# EAGLE design BoilerInterfaceV00 (EAGLE 8.5.2)
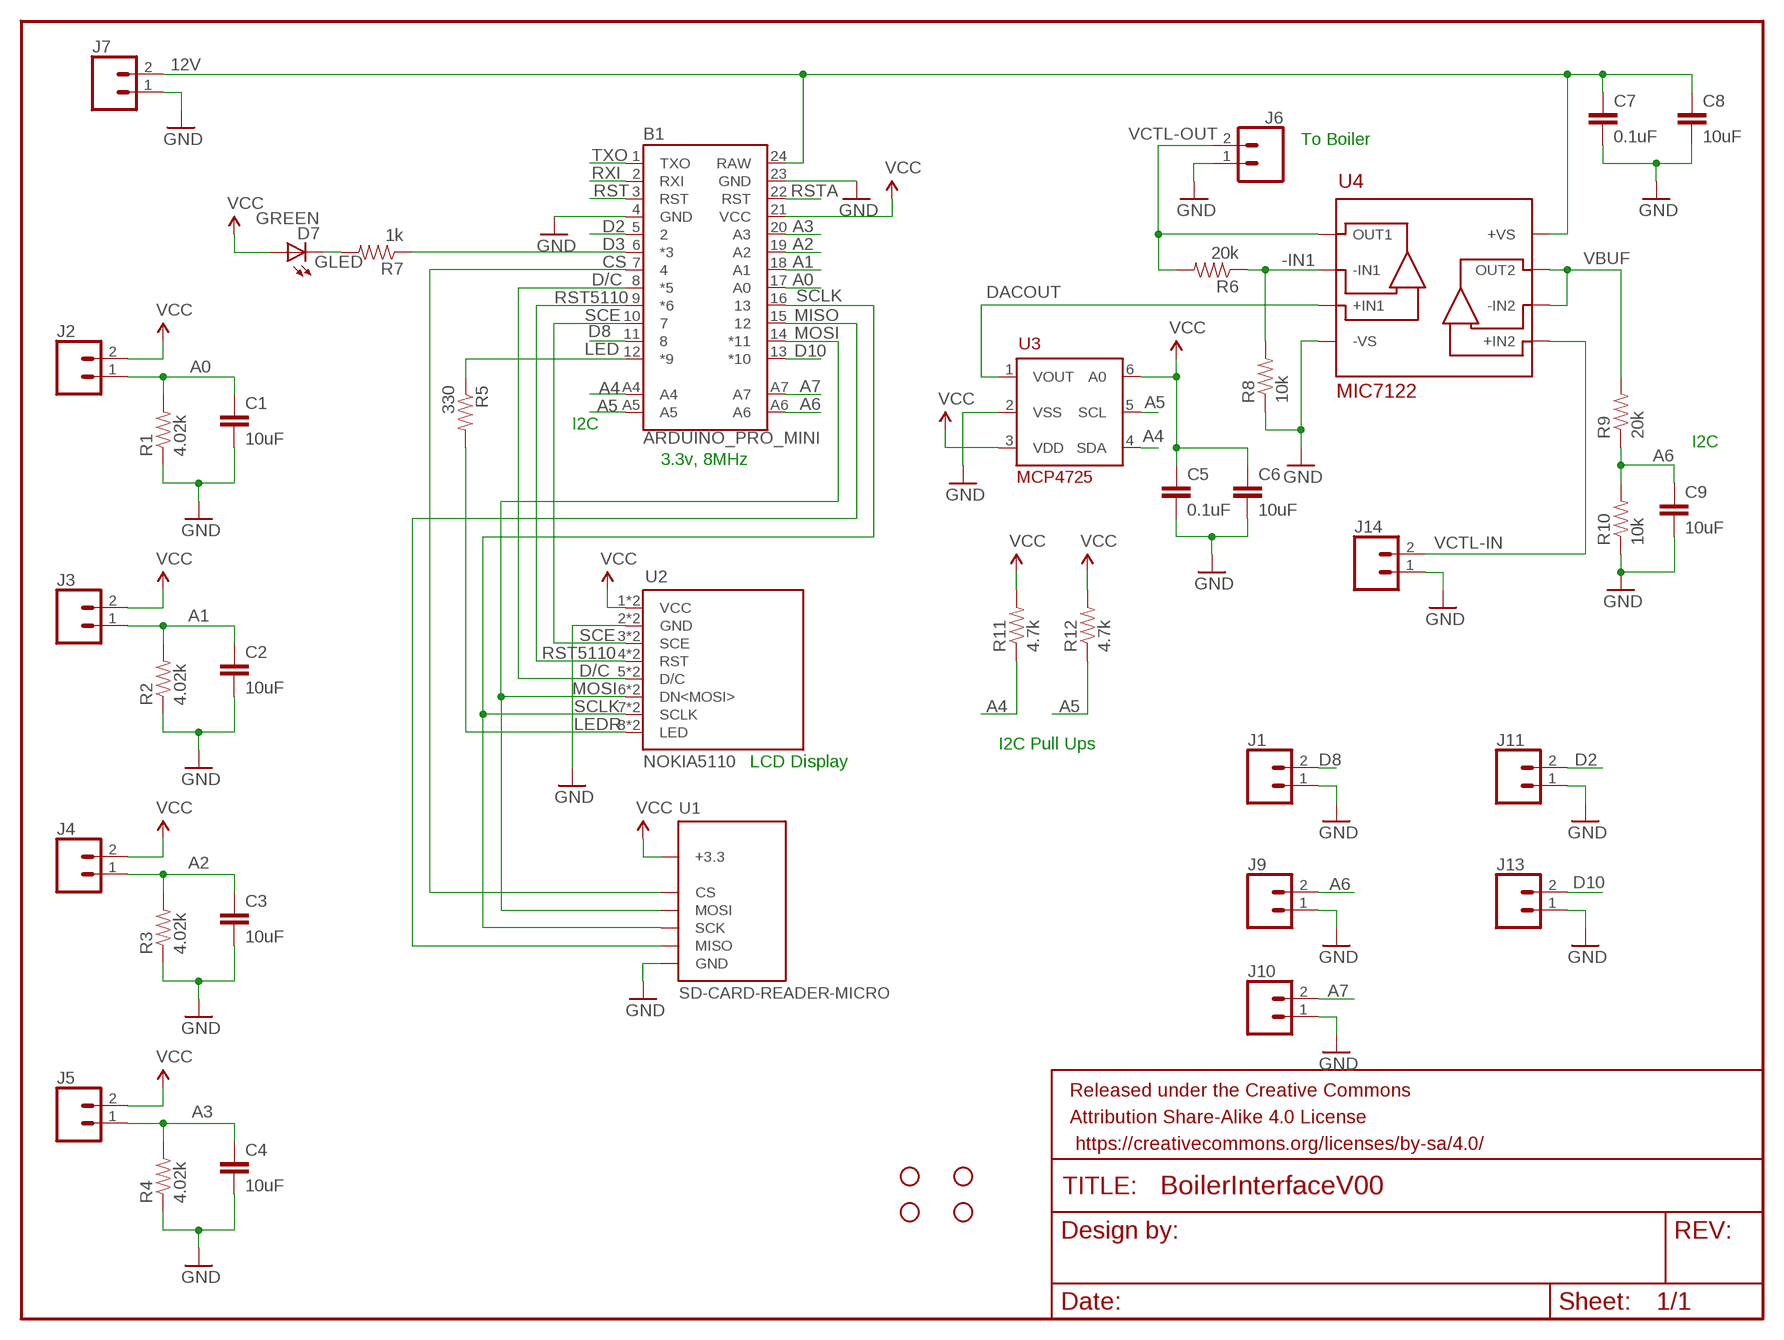
[diagram p0: schematic, sheet 1]

## Parts
B1  ARDUINO_PRO_MINI  [ARDUINO_PRO_MINI]
C1  10uF  CAP0805  [0805]
C2  10uF  CAP0805  [0805]
C3  10uF  CAP0805  [0805]
C4  10uF  CAP0805  [0805]
C5  0.1uF  CAP0805  [0805]
C6  10uF  CAP0805  [0805]
C7  0.1uF  CAP0805  [0805]
C8  10uF  CAP0805  [0805]
C9  10uF  CAP0805  [0805]
D7  GREEN  LED-GREEN0603  [LED-0603]
FRAME1  FRAME-LETTER  [CREATIVE_COMMONS]
J1  CONN_02  [1X02]
J2  CONN_025MM  [SCREWTERMINAL-5MM-2]
J3  CONN_025MM  [SCREWTERMINAL-5MM-2]
J4  CONN_025MM  [SCREWTERMINAL-5MM-2]
J5  CONN_025MM  [SCREWTERMINAL-5MM-2]
J6  CONN_025MM  [SCREWTERMINAL-5MM-2]
J7  CONN_025MM  [SCREWTERMINAL-5MM-2]
J9  CONN_02  [1X02]
J10  CONN_02  [1X02]
J11  CONN_02  [1X02]
J13  CONN_02  [1X02]
J14  CONN_025MM  [SCREWTERMINAL-5MM-2]
R1  4.02k  RESISTOR0805-RES  [0805]
R2  4.02k  RESISTOR0805-RES  [0805]
R3  4.02k  RESISTOR0805-RES  [0805]
R4  4.02k  RESISTOR0805-RES  [0805]
R5  330  RESISTOR0603  [0603-RES]
R6  20k  RESISTOR0805-RES  [0805]
R7  1k  RESISTOR0805-RES  [0805]
R8  10k  RESISTOR0805-RES  [0805]
R9  20k  RESISTOR0805-RES  [0805]
R10  10k  RESISTOR0805-RES  [0805]
R11  4.7k  RESISTOR0805-RES  [0805]
R12  4.7k  RESISTOR0805-RES  [0805]
STANDOFF1  STAND-OFF  [STAND-OFF]
STANDOFF2  STAND-OFF  [STAND-OFF]
STANDOFF3  STAND-OFF  [STAND-OFF]
STANDOFF4  STAND-OFF  [STAND-OFF]
U1  SD-CARD-READER-MICRO  [MICROSD_MOLEX]
U2  NOKIA5110  [NOKIA5110]
U3  MCP4725  [SOT23-6L]
U4  MIC7122  [MSOP8]

## Nets
12V: B1.24(RAW) C7.1 C8.1 J7.2 U4.8(+VS)
-IN1: R6.1 R8.2 U4.2(-IN1)
A0: B1.17(A0) C1.1 J2.1 R1.2
A1: B1.18(A1) C2.1 J3.1 R2.2
A2: B1.19(A2) C3.1 J4.1 R3.2
A3: B1.20(A3) C4.1 J5.1 R4.2
A4: B1.A4 R11.1 U3.4(SDA)
A5: B1.A5 R12.1 U3.5(SCL)
A6: B1.A6 C9.1 J9.2 R9.1 R10.2
A7: B1.A7 J10.2
CS: B1.7 U1.P$2(CS)
D2: B1.5 J11.2
D3: B1.6(*3) R7.1
D8: B1.11 J1.2
D10: B1.13(*10) J13.2
D/C: B1.8(*5) U2.5(D/C) U2.13(D/C)
DACOUT: U3.1(VOUT) U4.3(+IN1)
GLED: D7.C R7.2
GND: B1.4(GND) B1.23(GND) C1.2 C2.2 C3.2 C4.2 C5.2 C6.2 C7.2 C8.2 C9.2 J1.1 J6.1 J7.1 J9.1 J10.1 J11.1 J13.1 J14.1 R1.1 R2.1 R3.1 R4.1 R8.1 R10.1 U1.P$6(GND) U1.P$9(GND) U1.P$10(GND) U1.P$11(GND) U1.P$12(GND) U2.2(GND) U2.10(GND) U3.2(VSS) U4.4(-VS)
LED: B1.12(*9) R5.1
LEDR: R5.2 U2.8(LED) U2.16(LED)
MISO: B1.15 U1.P$7(MISO)
MOSI: B1.14(*11) U1.P$3(MOSI) U2.6(DN<MOSI>) U2.14(DN<MOSI>)
RST: B1.3(RST)
RST5110: B1.9(*6) U2.4(RST) U2.12(RST)
RSTA: B1.22(RST)
RXI: B1.2(RXI)
SCE: B1.10 U2.3(SCE) U2.11(SCE)
SCLK: B1.16 U1.P$5(SCK) U2.7(SCLK) U2.15(SCLK)
TXO: B1.1(TXO)
VBUF: R9.2 U4.6(-IN2) U4.7(OUT2)
VCC: B1.21(VCC) C5.1 C6.1 D7.A J2.2 J3.2 J4.2 J5.2 R11.2 R12.2 U1.P$4(+3.3) U2.1(VCC) U2.9(VCC) U3.3(VDD) U3.6(A0)
VCTL-IN: J14.2 U4.5(+IN2)
VCTL-OUT: J6.2 R6.2 U4.1(OUT1)

## Notes on the sheet
- To Boiler
- I2C
- I2C
- 3.3v, 8MHz
- I2C Pull Ups
- LCD Display

## Library data of the parts
B1 = SparkFun-Boards:ARDUINO_PRO_MINI: SparkFun Pro Mini Pro Mini compatible footprint. Dimensions: 0.7 x 1.3" PCB Thickness: 0.8mm SparkFun Products: 3.3V/8MHz <https://www.sparkfun.com/products/11114> 5V/16MHz <https://www.sparkfun.com/products/11113>
C1-C9 = SparkFun-Passives:CAP: Capacitor Standard 0603 ceramic capacitor, and 0.1" leaded capacitor.
D7 = SparkFun-LED:LED-GREEN: Various green LEDs Green LEDs used in SFE Production 0603- DIO-00821 LARGE- DIO-00862 LILYPAD- DIO-09910; PROD_ID: DIO-00821
FRAME1 = SparkFun-Aesthetics:FRAME-LETTER: Schematic Frame Standard 8.5x11 US Letter frame
J1 J9-J11 J13 = SparkFun-Connectors:CONN_02: Multi connection point. Often used as Generic Header-pin footprint for 0.1 inch spaced/style header connections On any of the 0.1 inch spaced packages, you can populate with these: Break Away Headers - Straight <https://www.sparkfun.com/products/116> (PRT-00116) Break Away Male Headers - Right Angle <https://www.sparkfun.com/products/553> (PRT-00553) Female Headers <https://www.sparkfun.com/products/115> (PRT-00115) Break Away Headers - Machine Pin <https://www.sparkfun.com/products/117> (PRT-00117) Break Away Female Headers - Swiss Machine Pin <https://www.sparkfun.com/products/743> (PRT-00743) For SCREWTERMINALS and SPRING TERMINALS visit here: Screw Terimnals on SparkFun.com <https://www.sparkfun.com/search/results?term=Screw+Terminals> (5mm/3.5mm/2.54mm spacing) This device is also useful as a general connection point to wire up your design to another part of your project. Our various solder wires solder well into these plated through hole pads. Hook-Up Wire - Assortment (Stranded, 22 AWG) <https://www.sparkfun.com/products/11375> (PRT-11375) Hook-Up Wire - Assortment (Solid Core, 22 AWG) <https://www.sparkfun.com/products/11367> (PRT-11367) View the entire wire category on our website here <https://www.sparkfun.com/categories/141> Special notes: Molex polarized connector foot print use with: PRT-08233 with associated crimp pins and housings. 2.54_SCREWTERM for use with PRT-10571. 3.5mm Screw Terminal footprints for PRT-08084 5mm Screw Terminal footprints for use with PRT-08432
J2-J7 J14 = SparkFun-Connectors:CONN_02: Multi connection point. Often used as Generic Header-pin footprint for 0.1 inch spaced/style header connections On any of the 0.1 inch spaced packages, you can populate with these: Break Away Headers - Straight <https://www.sparkfun.com/products/116> (PRT-00116) Break Away Male Headers - Right Angle <https://www.sparkfun.com/products/553> (PRT-00553) Female Headers <https://www.sparkfun.com/products/115> (PRT-00115) Break Away Headers - Machine Pin <https://www.sparkfun.com/products/117> (PRT-00117) Break Away Female Headers - Swiss Machine Pin <https://www.sparkfun.com/products/743> (PRT-00743) For SCREWTERMINALS and SPRING TERMINALS visit here: Screw Terimnals on SparkFun.com <https://www.sparkfun.com/search/results?term=Screw+Terminals> (5mm/3.5mm/2.54mm spacing) This device is also useful as a general connection point to wire up your design to another part of your project. Our various solder wires solder well into these plated through hole pads. Hook-Up Wire - Assortment (Stranded, 22 AWG) <https://www.sparkfun.com/products/11375> (PRT-11375) Hook-Up Wire - Assortment (Solid Core, 22 AWG) <https://www.sparkfun.com/products/11367> (PRT-11367) View the entire wire category on our website here <https://www.sparkfun.com/categories/141> Special notes: Molex polarized connector foot print use with: PRT-08233 with associated crimp pins and housings. 2.54_SCREWTERM for use with PRT-10571. 3.5mm Screw Terminal footprints for PRT-08084 5mm Screw Terminal footprints for use with PRT-08432; SF_SKU: PRT-08432
R1-R4 R6 R8-R12 = SparkFun-Passives:RESISTOR: Resistor Basic schematic elements and footprints for 0603, 1206, and PTH resistors.
R5 R7 = SparkFun-Resistors:RESISTOR: Resistor Basic schematic elements and footprints for 0603, 1206, and PTH resistors.
STANDOFF1-STANDOFF4 = SparkFun-Electromechanical:STAND-OFF: #4 Stand Off This is the mechanical footprint for a #4 phillips button head screw. Use the keepout ring to avoid running the screw head into surrounding components. SKU : PRT-00447
U1 = KDA:SD-CARD-READER-MICRO
U2 = KDA:NOKIA5110
U3 = KDA:MCP4725
U4 = KDA:MIC7122

## Board
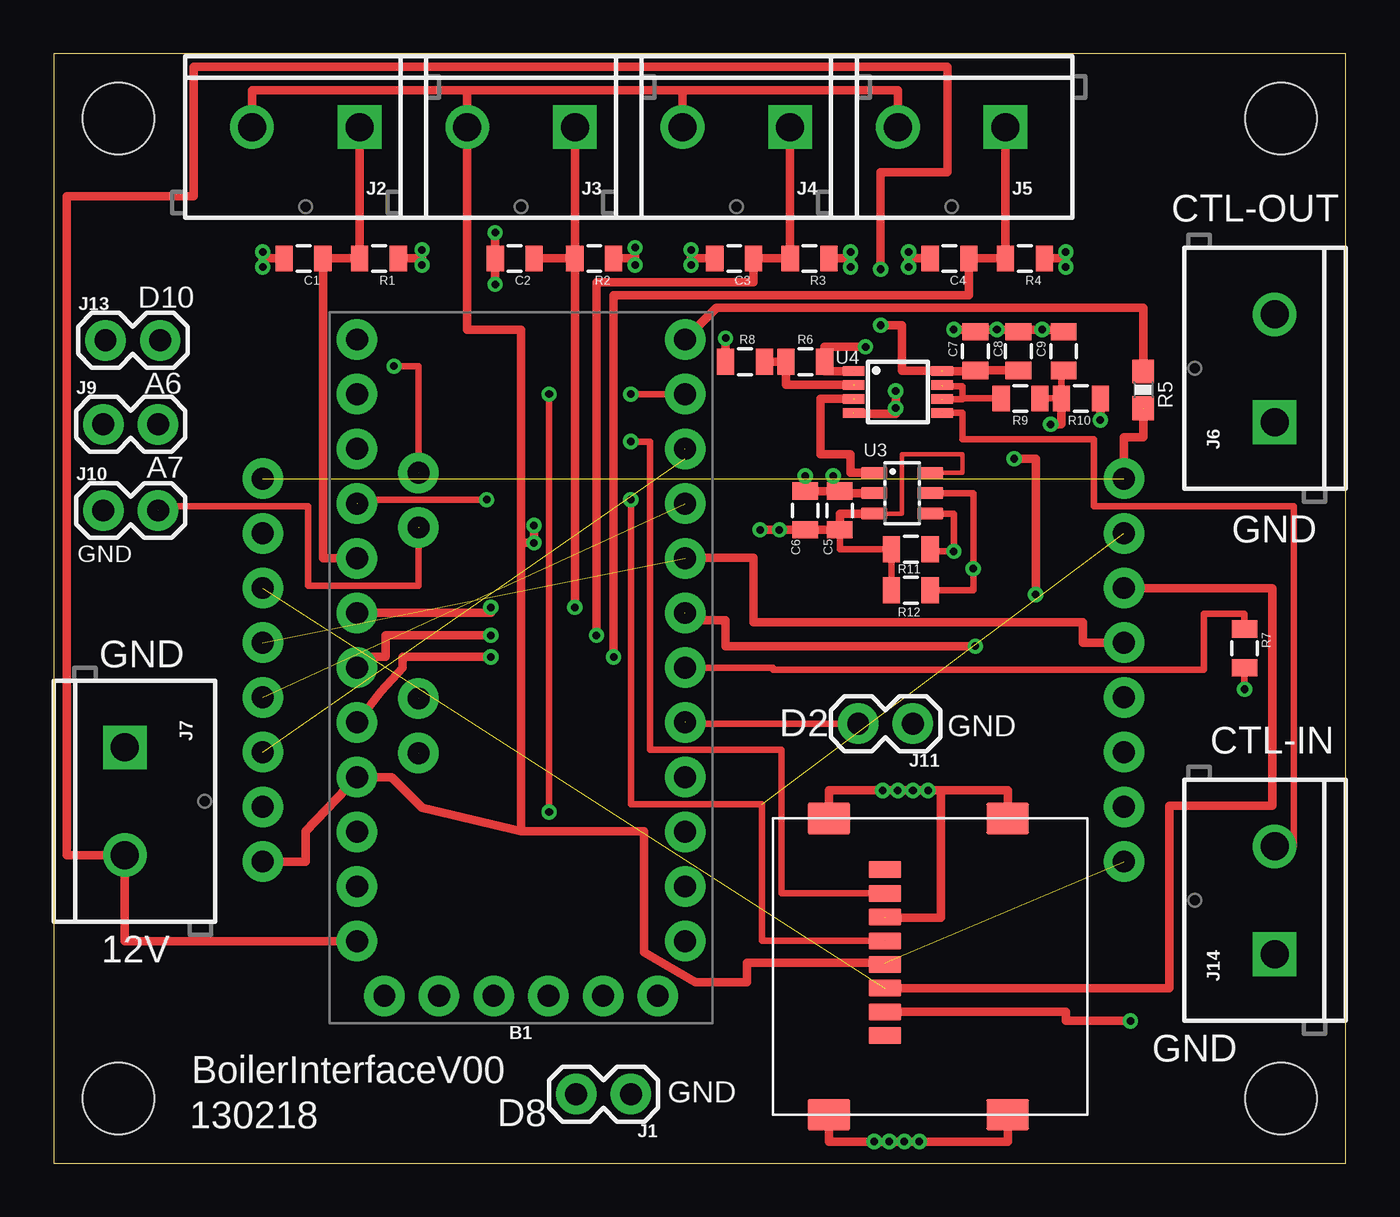
[diagram p1: board, top side]
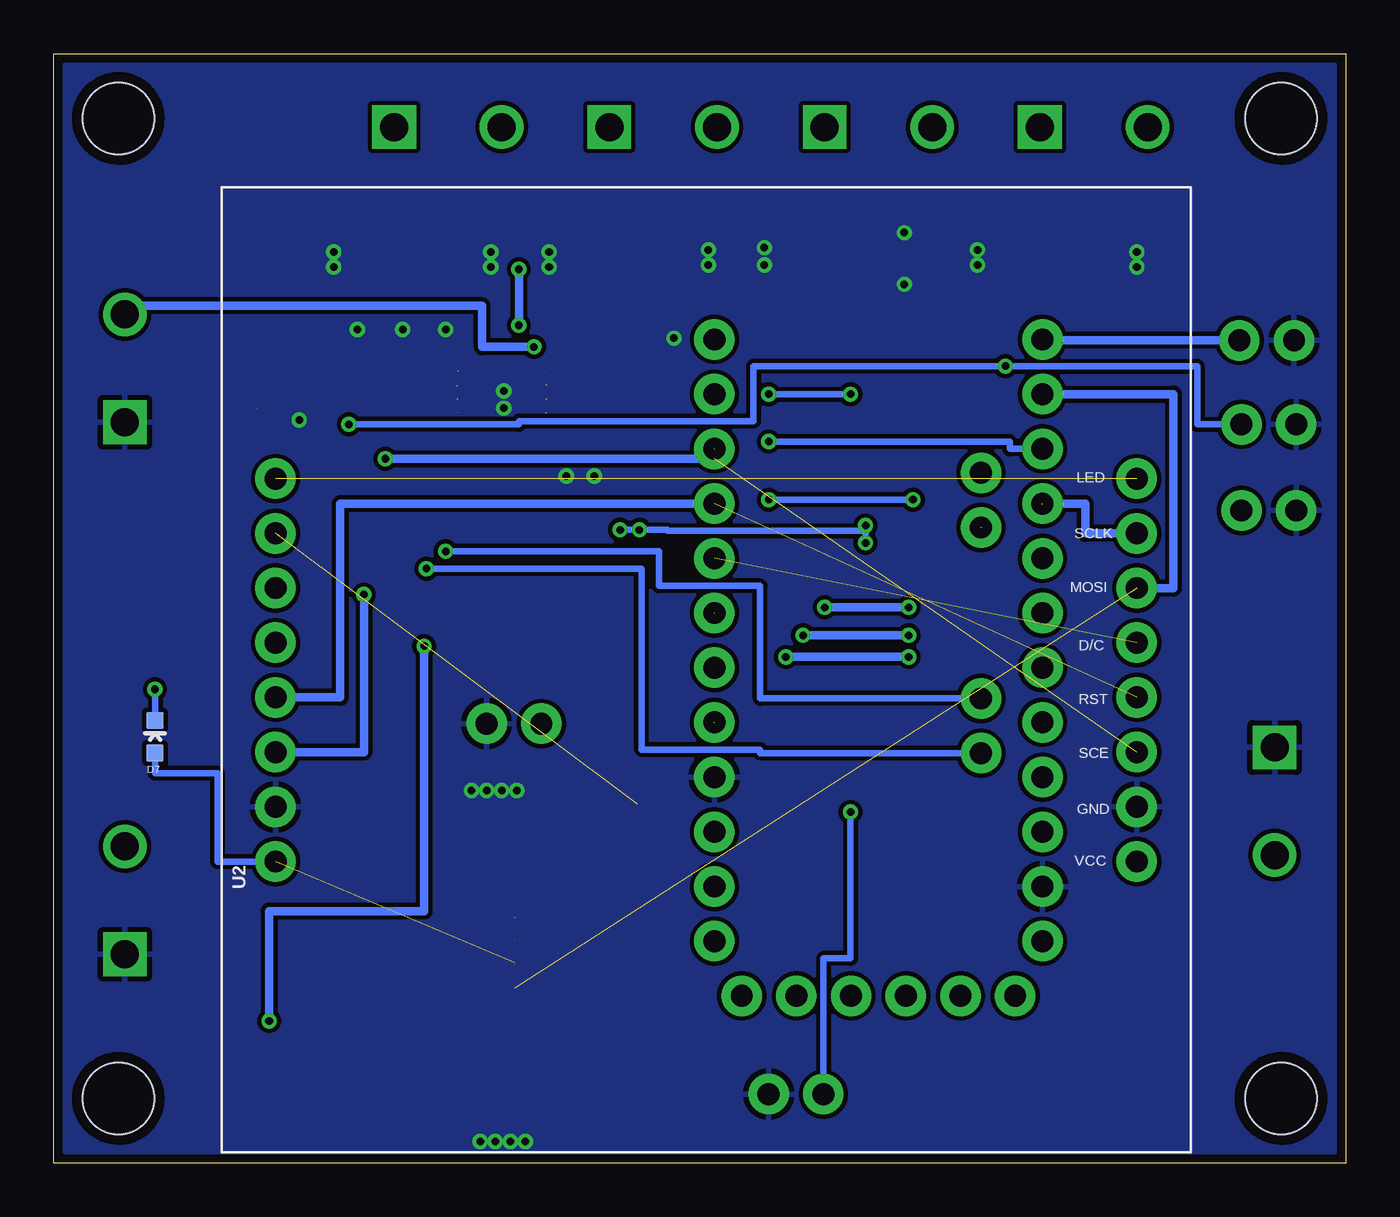
[diagram p2: board, bottom side, seen from below]

Size 60 x 51.5 mm. Coordinates in mm from the lower left corner, seen from the top.
Outline: 0,0 60,0 60,51.5 0,51.5 0,0
Copper layers (1*16): Top 0.0356mm / dielectric 1.5011mm / Bottom 0.0356mm
Design rules "Oshpark_mm": minimum track width 0.15mm, minimum drill 0.33mm, track to track 0.15mm, track to pad 0.15mm, pad to pad 0.15mm, via to via 0.15mm, smd to smd 0.15mm, copper to edge 0.38mm, drill to drill 0.15mm, minimum pad ring 7mil, minimum via ring 7mil, stop-mask expansion 3mil, vias tented up to drill 0mil, thermal gap 10mil

### Footprints (pad centres in the part's own frame; a part is rotated, then mirrored left to right if it is on the bottom)
ARDUINO_PRO_MINI = drill 1.016 pad 1.88: 1 -7.62,12.7; 2 -7.62,10.16; 3 -7.62,7.62; 4 -7.62,5.08; 5 -7.62,2.54; 6 -7.62,0; 7 -7.62,-2.54; 8 -7.62,-5.08; 9 -7.62,-7.62; 10 -7.62,-10.16; 11 -7.62,-12.7; 12 -7.62,-15.24; 13 7.62,-15.24; 14 7.62,-12.7; 15 7.62,-10.16; 16 7.62,-7.62; 17 7.62,-5.08; 18 7.62,-2.54; 19 7.62,0; 20 7.62,2.54; 21 7.62,5.08; 22 7.62,7.62; 23 7.62,10.16; 24 7.62,12.7; A4 4.763,1.429; A5 4.763,3.969; A6 4.763,-9.049; A7 4.763,-6.509; BLK -6.35,15.24; GND -3.81,15.24; GRN 6.35,15.24; RXI 1.27,15.24; TXO 3.81,15.24; VCC -1.27,15.24
0805 = smd 0.8 x 1.2: 1 -0.9,0; 2 0.9,0
LED-0603 = smd 0.8 x 0.8: A 0,-0.75; C 0,0.75
1X02 = drill 1.016 pad 1.88: 1 0,0; 2 2.54,0
SCREWTERMINAL-5MM-2 = drill 1.3 pad 2.032 square: 1 0,0 | drill 1.3 pad 2.032: 2 5,0
0603-RES = smd 1.1 x 1: 1 -0.85,0; 2 0.85,0
STAND-OFF = hole 3.302: 0,0
MICROSD_MOLEX = smd 0.8 x 1.5: P$1 10.08,2.6; P$2 8.98,2.6; P$3 7.88,2.6; P$4 6.78,2.6; P$5 5.68,2.6; P$6 4.58,2.6; P$7 3.48,2.6; P$8 2.38,2.6 | smd 1.45 x 2: P$9 0,0; P$10 13.75,0; P$11 13.75,8.3; P$12 0,8.3
NOKIA5110 = drill 1.016 pad 1.88: 1 0,0; 2 0,2.54; 3 0,5.08; 4 0,7.62; 5 0,10.16; 6 0,12.7; 7 0,15.24; 8 0,17.78; 9 40,0; 10 40,2.54; 11 40,5.08; 12 40,7.62; 13 40,10.16; 14 40,12.7; 15 40,15.24; 16 40,17.78
SOT23-6L = smd 0.55 x 1.2: 1 -0.95,-1.3; 2 0,-1.3; 3 0.95,-1.3; 4 0.95,1.3; 5 0,1.3; 6 -0.95,1.3
MSOP8 = smd 0.45 x 1: 1 -0.975,-2.05; 2 -0.325,-2.05; 3 0.325,-2.05; 4 0.975,-2.05; 5 0.975,2.05; 6 0.325,2.05; 7 -0.325,2.05; 8 -0.975,2.05

### Placement (x,y rotation side)
B1  21.7,23 180 top
C1  11.6,42 180 top
C2  21.4,42 180 top
C3  31.6,42 180 top
C4  41.6,42 180 top
C5  36.5,30.3 90 top
C6  34.9,30.3 90 top
C7  42.8,37.7 90 top
C8  44.8,37.7 90 top
C9  46.9,37.7 90 top
D7  55.3,19.8 0 bottom
FRAME1  0,0 0 top
J1  26.8,3.2 180 top
J2  14.2,48.1 180 top
J3  24.2,48.1 180 top
J4  34.2,48.1 180 top
J5  44.2,48.1 180 top
J6  56.7,34.4 90 top
J7  3.3,19.3 270 top
J9  2.3,34.3 0 top
J10  2.3,30.3 0 top
J11  39.9,20.4 180 top
J13  2.4,38.2 0 top
J14  56.7,9.7 90 top
R1  15.1,42 180 top
R2  25.1,42 180 top
R3  35.1,42 180 top
R4  45.1,42 180 top
R5  50.6,35.9 270 top
R6  34.9,37.2 0 top
R7  55.3,23.9 270 top
R8  32.1,37.2 0 top
R9  44.9,35.5 180 top
R10  47.7,35.5 180 top
R11  39.8,28.5 180 top
R12  39.8,26.6 180 top
STANDOFF1  3,3 0 top
STANDOFF2  57,48.5 0 top
STANDOFF3  57,3 0 top
STANDOFF4  3,48.5 0 top
U1  36,16 270 top
U2  49.7,14 0 bottom
U3  39.4,31.1 270 top
U4  39.2,35.8 270 top

### Tracks (layer width: path | path; a pad name or v marks a point on that pad's centre or on a via)
12V  (via drill 0.35)  (2 unrouted)
  Top 0.4: B1.24 3.3,10.3 J7.2 0.6,14.3 0.6,44.9 6.5,44.9 6.5,50.9 41.5,50.9 41.5,46 38.4,46 v38.4,41.5 | C8.1 C7.1 42.8,36.77 U4.8 | U4.8 39.4,36.78 39.4,38.9 v38.4,38.9
  Bottom 0.4: v38.4,38.9 v38.4,41.5
-IN1  (1 unrouted)
  Top 0.4: R8.2 R6.1 34,36.13 U4.2
A0
  Top 0.4: J2.1 R1.2 C1.1 12.5,28.08 B1.17
A1  (via drill 0.35)
  Top 0.4: R2.2 J3.1 | C2.1 R2.2 | R2.2 v24.2,25.8 | v20.3,25.8 20.3,25.54 B1.18
  Bottom 0.4: v20.3,25.8 v24.2,25.8
A2  (via drill 0.35)
  Top 0.4: J4.1 R3.2 C3.1 32.5,40.9 25.2,40.9 v25.2,24.5 | v20.3,24.5 15.4,24.5 15.4,23.5 14.08,23.5 B1.19
  Bottom 0.4: v25.2,24.5 v20.3,24.5
A3  (via drill 0.35)
  Top 0.4: J5.1 R4.2 C4.1 42.5,40.3 26,40.3 v26,23.5 | v20.3,23.5 16.2,23.5 16.2,23 15.2,21.9 B1.20
  Bottom 0.4: v26,23.5 v20.3,23.5
A4  (via drill 0.35)  (1 unrouted)
  Top 0.3: U3.4 41.8,30.15 v41.8,28.4 40.7,28.4 R11.1
  Bottom 0.3: B1.A4 27.2,21.57 27.2,26.8 31.9,26.8 31.9,28.4 v41.8,28.4
A5  (via drill 0.35)  (1 unrouted)
  Top 0.3: U3.5 42.7,31.1 v42.7,27.6 42.7,26.6 R12.1
  Bottom 0.3: B1.A5 27.2,19.03 27.2,19.2 32.7,19.2 32.7,27.6 v42.7,27.6
A6  (via drill 0.35)  (1 unrouted)
  Top 0.3: B1.A6 16.94,37 v15.8,37 | R9.1 R10.2 46.8,36.8 C9.1
  Top 0.4: v46.3,34.3 46.8,34.3 R10.2
  Bottom 0.3: J9.2 6.9,34.3 6.9,37 v15.8,37 27.5,37 27.5,34.45 38.4,34.45 38.4,34.3 v46.3,34.3
A7  (2 unrouted)
  Top 0.3: B1.A7 16.94,26.8 11.8,26.8 11.8,30.5 4.85,30.5 J10.2
CS  (via drill 0.35)  (1 unrouted)
  Top 0.4: B1.7 29.32,25.2 31.2,25.2 31.2,24 v42.8,24 | v50,6.6 47,6.6 47,7.02 U1.P$2
  Bottom 0.4: v42.8,24 42.8,11.7 50,11.7 v50,6.6
D2  (1 unrouted)
  Top 0.3: J11.2 29.33,20.4 B1.5
D3
  Top 0.3: B1.6 33.4,23 33.4,22.9 53.4,22.9 53.4,25.5 55.3,25.5 R7.1
D8  (via drill 0.35)
  Top 0.3: B1.11 v26.8,35.7 | v23,35.7 v23,16.3
  Bottom 0.3: v26.8,35.7 v23,35.7 | v23,16.3 23,9.5 24.25,9.5 J1.2
D10
  Bottom 0.4: J13.2 14.08,38.2 B1.13
D/C  (1 unrouted)
  Top 0.4: B1.8 29.32,28.1 32.5,28.1 32.5,25.1 47.8,25.1 47.8,24.16 U2.5
DACOUT  (1 unrouted)
  Top 0.4: U4.3 35.6,35.48 35.6,32.9 37,32.9 37,32.05 U3.1
GLED  (via drill 0.35)
  Top 0.3: R7.2 v55.3,22
  Bottom 0.3: v55.3,22 D7.C
GND  (via drill 0.35)  (2 unrouted)
  Top 0.4: U1.P$9 36,17.3 v40.6,17.3 41.2,17.3 | 41.2,17.3 44.3,17.3 U1.P$12 | 38.6,11.4 41.2,11.4 41.2,17.3 | U1.P$10 36,1 v38.1,1 44.3,1 U1.P$11 | v9.7,42.3 v9.7,41.6 9.7,42 C1.2 | v17.1,42.4 v17.1,41.7 17.1,42 R1.1 | v20.5,43.2 C2.2 v20.5,40.8 | v27,42.5 v27,41.7 27,42 R2.1 | v29.6,42.4 v29.6,41.7 29.6,42 C3.2 | v37,42.3 v37,41.6 37,42 R3.1 | v39.7,42.3 v39.7,41.6 39.7,42 C4.2 | v47,42.3 v47,41.6 47,42 R4.1 | 36.2,31.2 C6.2 v34.9,31.9 | U3.2 36.5,31.1 C5.2 36.2,31.2 | 36.2,31.2 v36.2,31.9 | v39.1,35.85 v39.1,35.05 39.1,34.8 37.2,34.8 37.2,34.82 U4.4 | R8.1 v31.2,38.3 | v41.8,38.7 42.8,38.7 | C7.2 42.8,38.7 | 42.8,38.7 v43.8,38.7 44.8,38.7 | C8.2 44.8,38.7 | 44.8,38.7 v45.9,38.7 46.9,38.7 C9.2 | v48.6,34.5 R10.1
  other vias: 38.5,17.3 39.2,17.3 39.9,17.3 38.8,1 39.5,1 40.2,1
  pour Bottom (isolate 0.2): 0.5,0.5 0.5,51 59.5,51 59.5,0.5
LED
  Top 0.4: R5.1 50.6,39.7 30.78,39.7 B1.12
LEDR  (2 unrouted)
  Top 0.4: R5.2 50.61,33.7 49.7,33.7 U2.8
MISO  (via drill 0.35)
  Top 0.3: v26.8,33.5 27.7,33.5 27.7,19.2 33.8,19.2 33.8,12.52 U1.P$7
  Bottom 0.3: B1.15 15.6,33.16 15.6,33.5 v26.8,33.5
MOSI  (1 unrouted)
  Top 0.4: U2.6 56.6,26.7 56.6,16.6 51.8,16.6 51.8,8.12 U1.P$3
  Bottom 0.4: B1.14 8,35.7 8,26.7 U2.14
RST5110  (1 unrouted)
  Bottom 0.4: B1.9 46.7,30.62 46.7,21.62 U2.4
SCE  (via drill 0.35)  (2 unrouted)
  Top 0.4: v44.6,32.7 45.6,32.7 v45.6,26.4
  Bottom 0.4: v45.6,26.4 45.6,19.08 U2.3 | v44.6,32.7 29.32,32.7 B1.10
SCLK  (via drill 0.35)  (3 unrouted)
  Top 0.3: B1.16 14.08,30.8 v20.1,30.8 | v26.8,30.8 26.8,16.66 32.9,16.66 32.9,10.33 U1.P$5
  Bottom 0.3: v20.1,30.8 v26.8,30.8
  Bottom 0.4: U2.15 12.1,29.24 12.1,30.62 14.1,30.62
VBUF  (2 unrouted)
  Top 0.3: 41.26,36.07 42.2,36.07 42.2,35.5 | 42.2,35.5 42.2,35.47 U4.6 | R9.2 42.2,35.5
VCC  (via drill 0.35)  (2 unrouted)
  Top 0.2: U3.3 39.4,30.15 39.4,32.9 42.2,32.9 42.2,32.05 U3.6
  Top 0.3: R12.2 R11.2 36.5,28.5 C5.1
  Top 0.4: 21.7,15.4 17.1,16.5 15.68,17.92 B1.21 11.7,15.4 11.7,14 U2.9 | 21.7,15.4 27.4,15.4 27.4,9.8 29.8,8.4 32.2,8.4 32.2,9.3 38.6,9.3 U1.P$4 | 21.7,15.4 21.7,28.8 | 21.7,28.8 21.7,38.7 19.2,38.7 J3.2 19.2,49.8 | 19.2,49.8 29.2,49.8 | 29.2,49.8 39.2,49.8 J5.2 | J4.2 29.2,49.8 | J2.2 9.2,49.8 19.2,49.8 | U3.3 36.5,30.15 C5.1 C6.1 v33.7,29.4 v32.8,29.4 | v22.3,29.6 v22.3,28.8 21.7,28.8
  Bottom 0.3: v22.3,28.8 v22.3,29.6 22.3,29.35 31.5,29.35 31.5,29.4 v32.8,29.4 v33.7,29.4 | U2.1 52.4,14 52.4,18.1 55.3,18.1 D7.A
VCTL-IN  (1 unrouted)
  Top 0.3: J14.2 57.6,14.7 57.6,30.5 48.3,30.5 48.3,33.6 42.2,33.6 42.2,34.83 U4.5
VCTL-OUT  (via drill 0.35)  (1 unrouted)
  Top 0.4: U4.1 35.8,36.77 R6.2 35.8,37.9 v37.7,37.9
  Bottom 0.4: v37.7,37.9 40.1,37.9 40.1,39.8 56.7,39.8 J6.2

### Text on the board
tPlace: CTL-OUT | D10 | A6 | A7 | GND | GND | GND | D2 | GND | CTL-IN | 12V | GND | BoilerInterfaceV00 | GND | 130218 | D8
bPlace: LED | SCLK | MOSI | D/C | RST | SCE | GND | VCC
tNames: U4 | U3